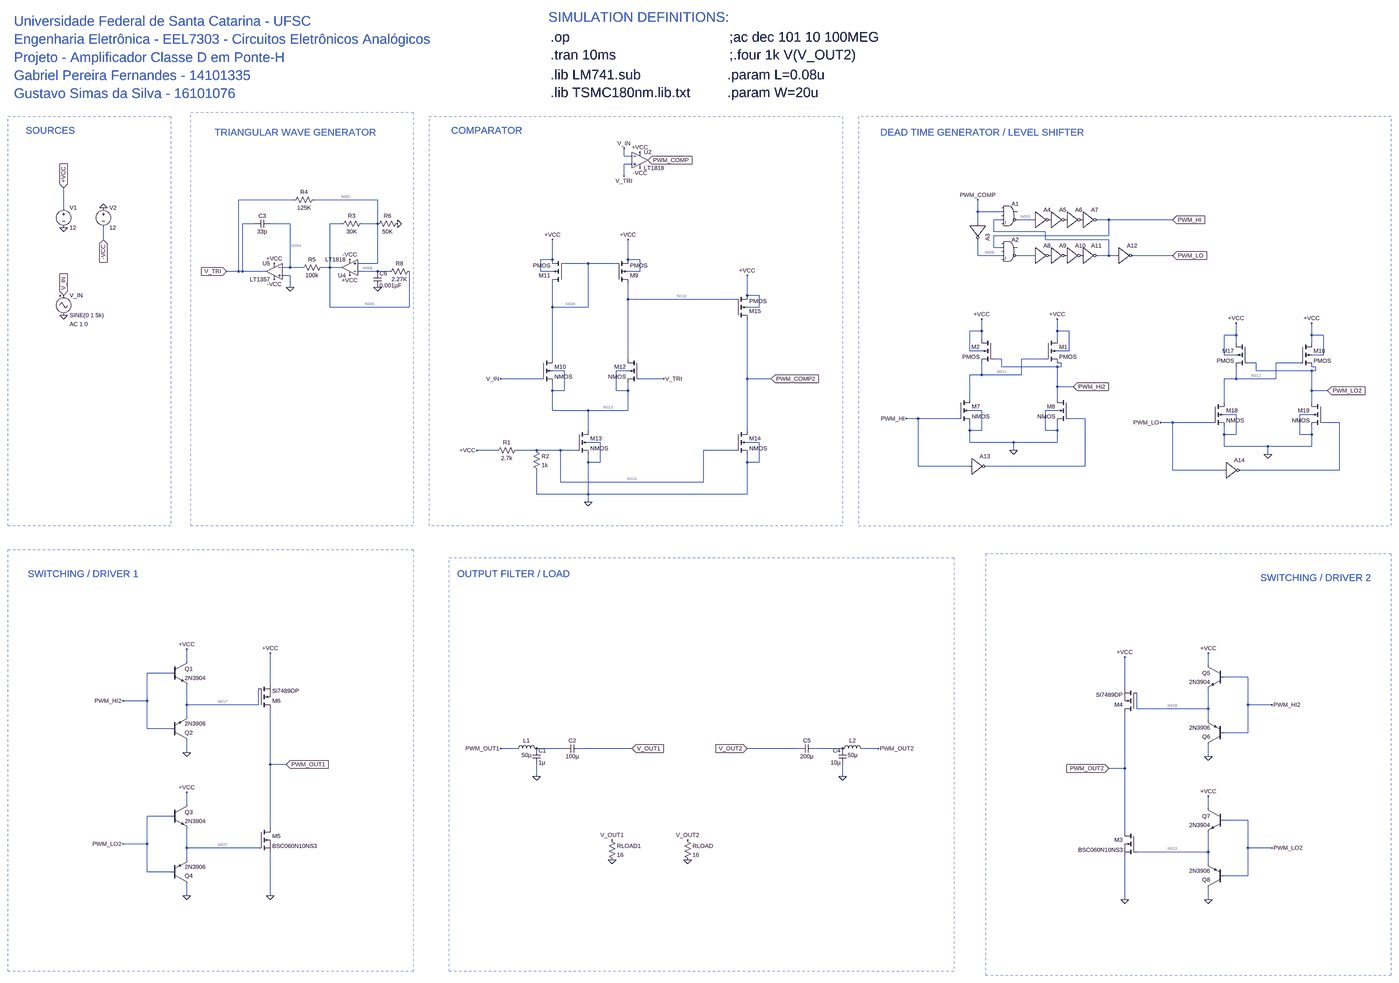
[diagram p0: schematic AmplificadorClasseD-V112.asc, whole sheet]
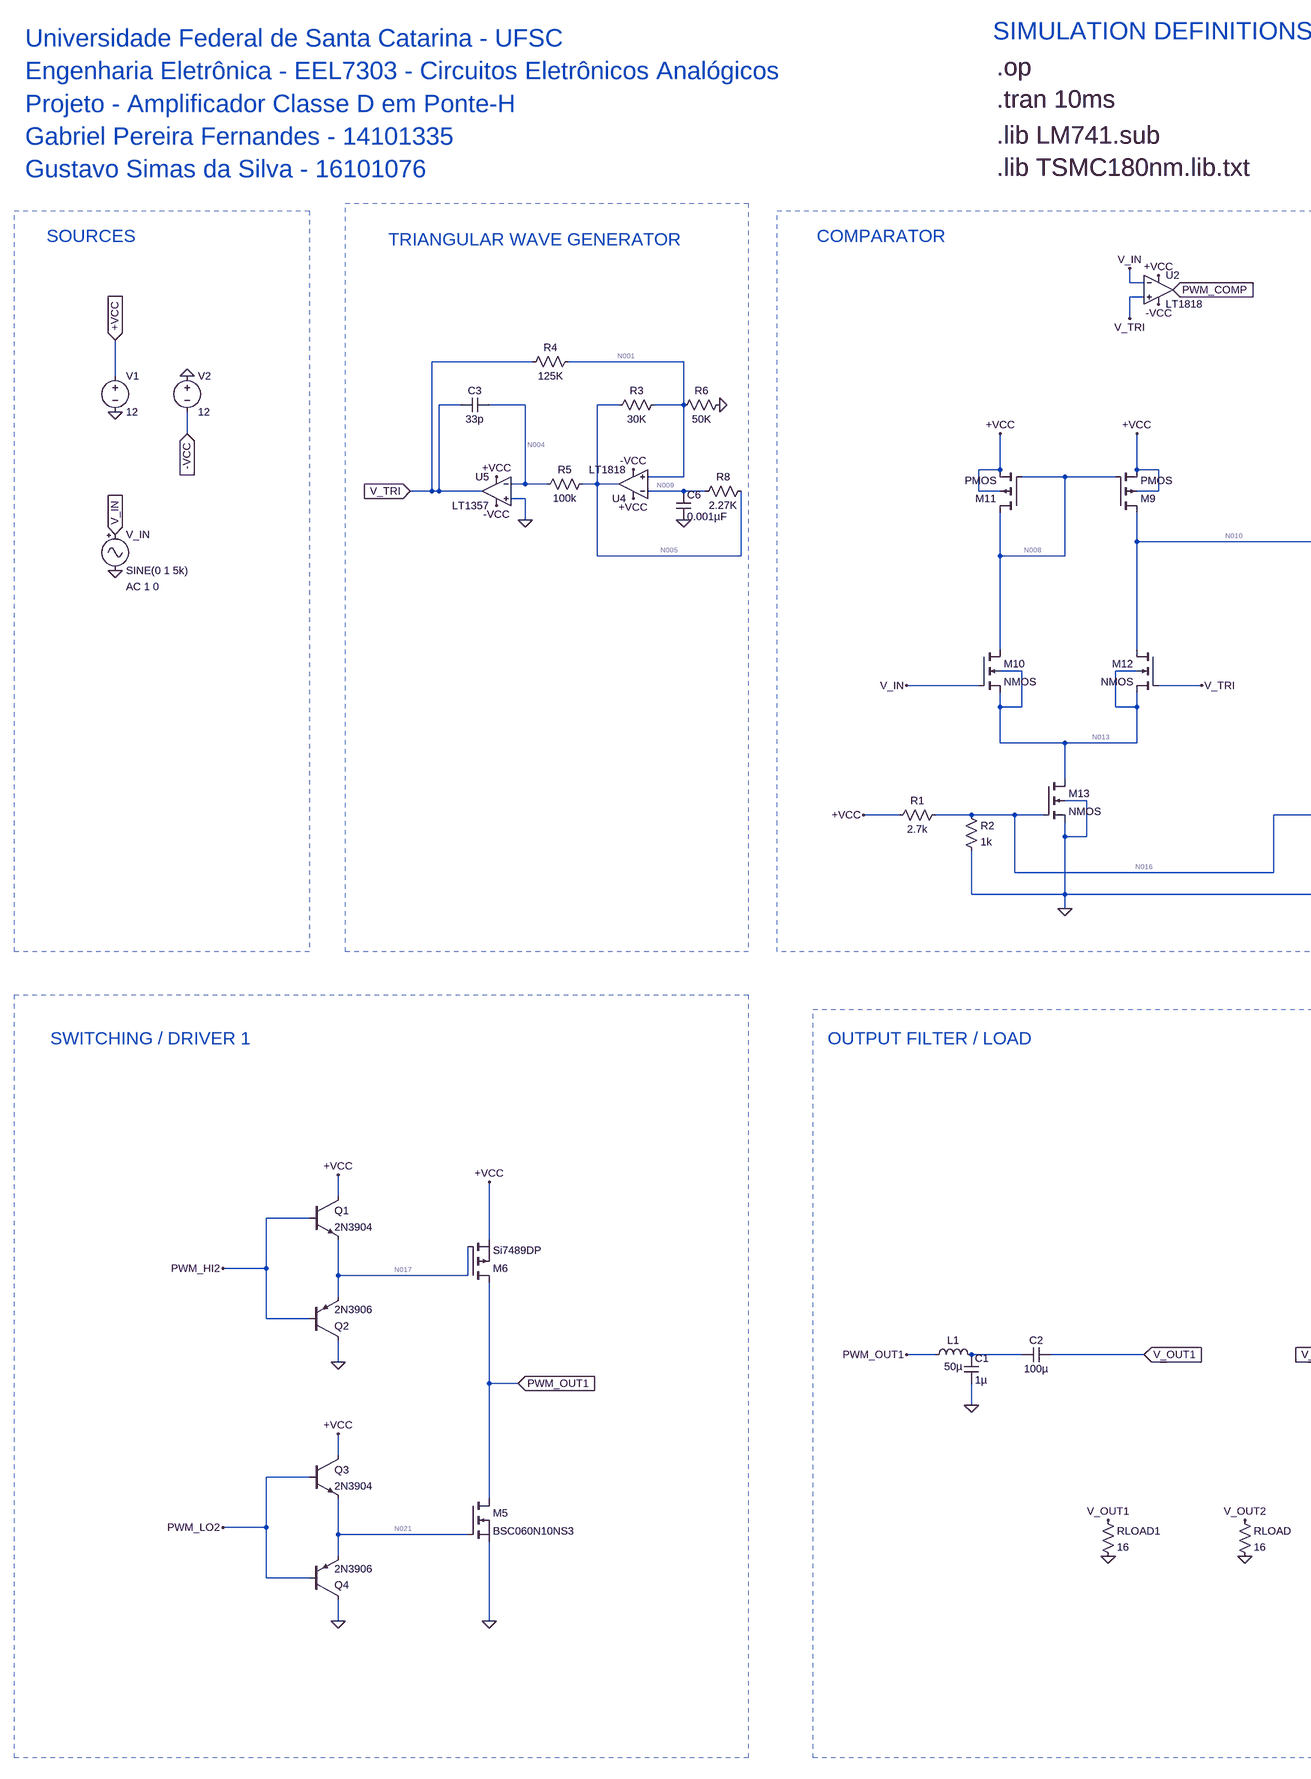
[diagram p1: schematic AmplificadorClasseD-V112.asc, part, row 1 of 1, column 1 of 2]
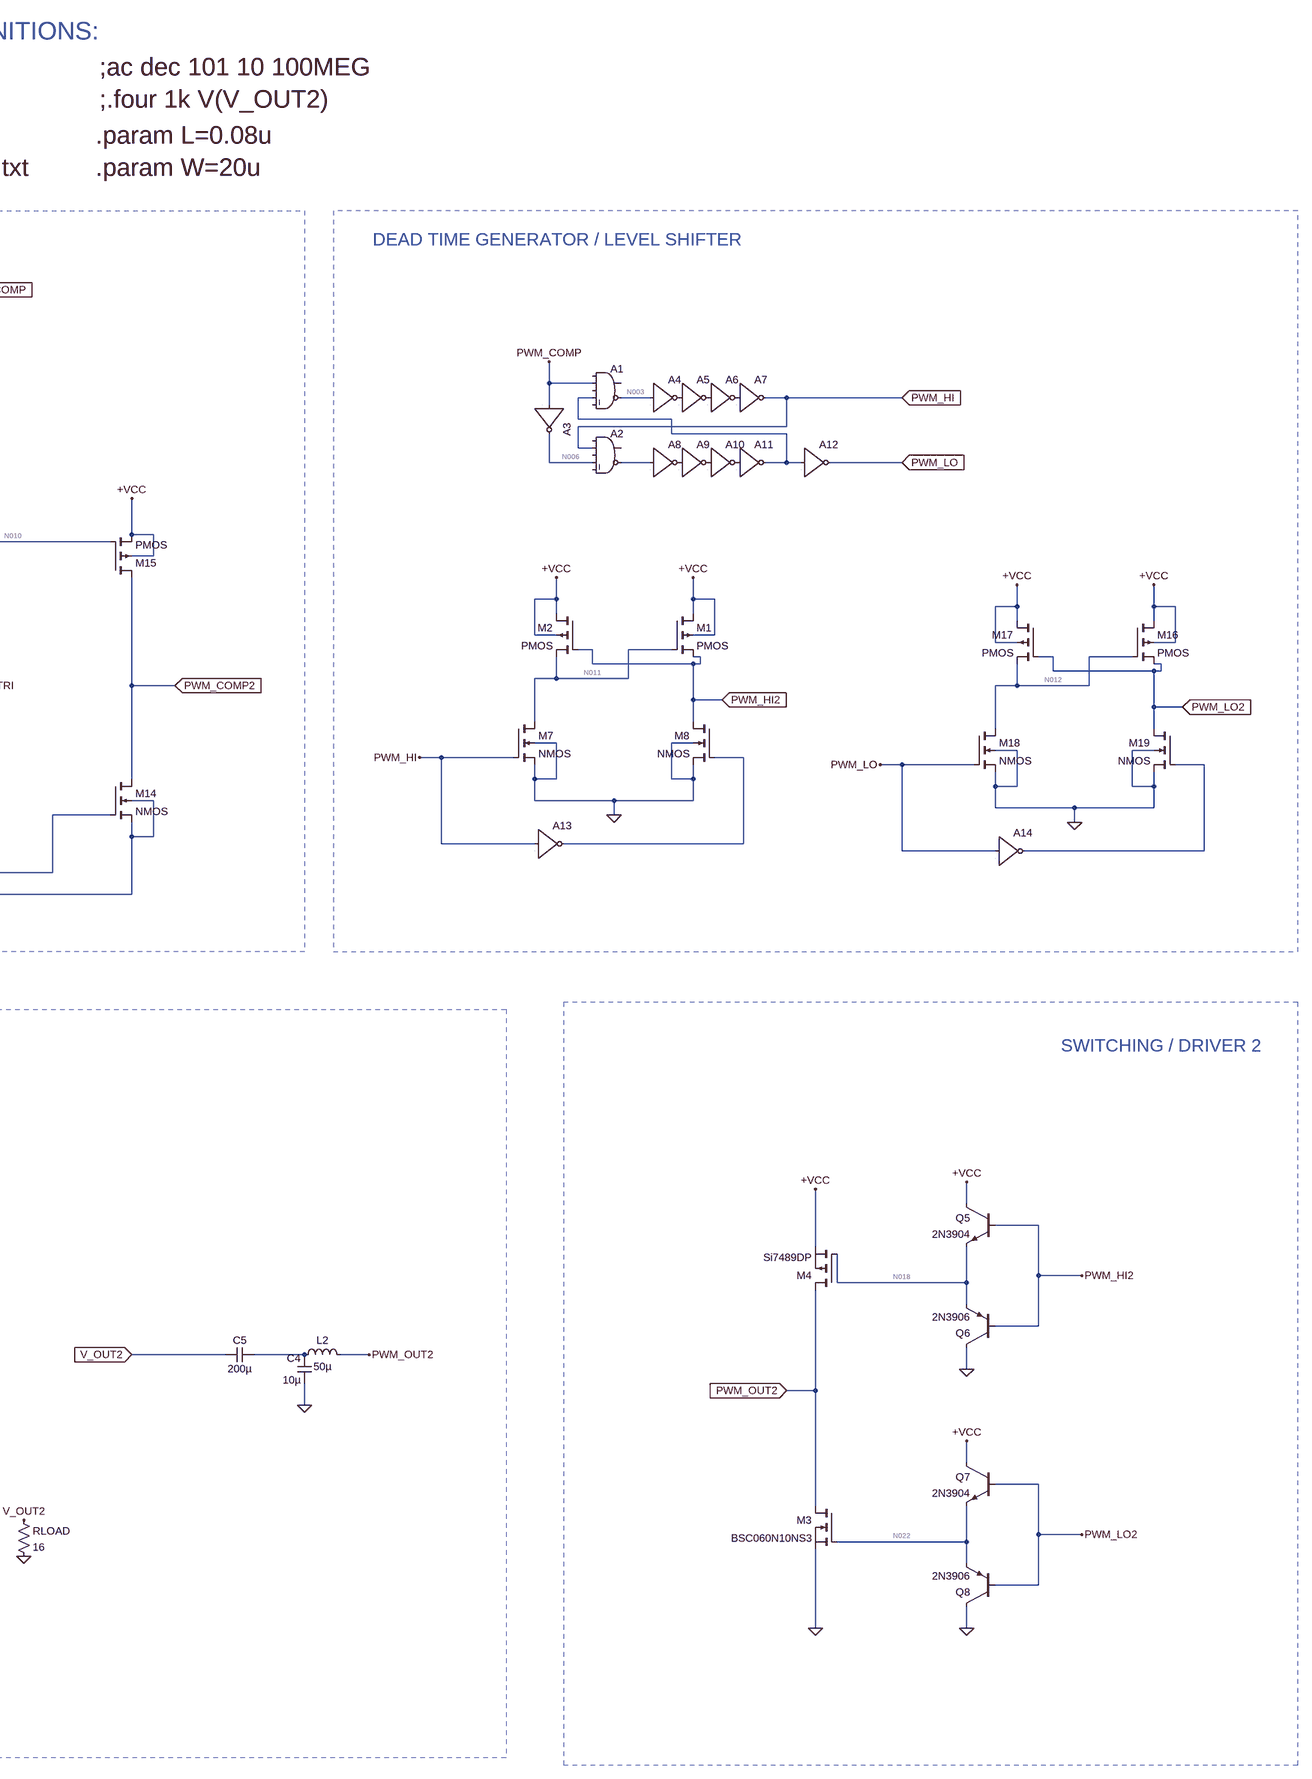
[diagram p2: schematic AmplificadorClasseD-V112.asc, part, row 1 of 1, column 2 of 2]
AmplificadorClasseD-V112.asc, the LTspice schematic file:
Version 4
SHEET 1 8820 3748
WIRE 1056 -560 1056 -592
WIRE 1088 -560 1056 -560
WIRE 1088 -528 1056 -528
WIRE 1056 -480 1056 -528
WIRE -272 -384 -496 -384
WIRE 64 -384 -192 -384
WIRE -1200 -352 -1200 -432
WIRE 2480 -336 2480 -384
WIRE 2576 -336 2480 -336
WIRE 2576 -304 2544 -304
WIRE 2704 -304 2640 -304
WIRE 3008 -304 2960 -304
WIRE 3264 -304 3008 -304
WIRE -432 -288 -480 -288
WIRE -288 -288 -368 -288
WIRE -80 -288 -128 -288
WIRE 64 -288 64 -384
WIRE 64 -288 0 -288
WIRE 2480 -288 2480 -336
WIRE 2544 -256 2544 -304
WIRE 2752 -256 2544 -256
WIRE 3008 -240 3008 -304
WIRE 3008 -240 2544 -240
WIRE -1040 -224 -1040 -272
WIRE 2752 -224 2752 -256
WIRE 3008 -224 2752 -224
WIRE 2544 -192 2544 -240
WIRE 2576 -192 2544 -192
WIRE 2480 -160 2480 -224
WIRE 2576 -160 2480 -160
WIRE 2704 -160 2640 -160
WIRE 3008 -160 3008 -224
WIRE 3008 -160 2960 -160
WIRE 3040 -160 3008 -160
WIRE 3264 -160 3104 -160
WIRE 768 -144 768 -224
WIRE 768 -144 720 -144
WIRE 1072 -144 1072 -224
WIRE 1120 -144 1072 -144
WIRE 64 -128 64 -288
WIRE 64 -128 -16 -128
WIRE 912 -128 816 -128
WIRE 1024 -128 912 -128
WIRE -288 -112 -288 -288
WIRE -288 -112 -320 -112
WIRE -240 -112 -288 -112
WIRE -128 -112 -128 -288
WIRE -128 -112 -160 -112
WIRE -80 -112 -128 -112
WIRE -496 -96 -496 -384
WIRE -496 -96 -544 -96
WIRE -480 -96 -480 -288
WIRE -480 -96 -496 -96
WIRE -384 -96 -480 -96
WIRE 64 -96 -16 -96
WIRE 112 -96 64 -96
WIRE 720 -96 720 -144
WIRE 768 -96 720 -96
WIRE 1120 -96 1120 -144
WIRE 1120 -96 1072 -96
WIRE -288 -80 -320 -80
WIRE -288 -32 -288 -80
WIRE 1552 0 1552 -80
WIRE 1600 0 1552 0
WIRE 1072 16 1072 -48
WIRE 1504 16 1072 16
WIRE -128 48 -128 -112
WIRE 192 48 192 -96
WIRE 192 48 -128 48
WIRE 768 48 768 -48
WIRE 912 48 912 -128
WIRE 912 48 768 48
WIRE 1600 48 1600 0
WIRE 1600 48 1552 48
WIRE 2496 144 2496 96
WIRE 2496 144 2448 144
WIRE 2800 144 2800 96
WIRE 2848 144 2800 144
WIRE 3520 160 3520 112
WIRE 3520 160 3472 160
WIRE 3824 160 3824 112
WIRE 3872 160 3824 160
WIRE 2496 176 2496 144
WIRE 2800 176 2800 144
WIRE 3520 192 3520 160
WIRE 3824 192 3824 160
WIRE 2448 224 2448 144
WIRE 2496 224 2448 224
WIRE 2848 224 2848 144
WIRE 2848 224 2800 224
WIRE 3472 240 3472 160
WIRE 3520 240 3472 240
WIRE 3872 240 3872 160
WIRE 3872 240 3824 240
WIRE 768 256 768 48
WIRE 1072 256 1072 16
WIRE 2576 256 2544 256
WIRE 2752 256 2656 256
WIRE 2816 272 2800 272
WIRE 3600 272 3568 272
WIRE 3776 272 3680 272
WIRE 2576 288 2576 256
WIRE 2800 288 2576 288
WIRE 2816 288 2816 272
WIRE 2816 288 2800 288
WIRE 3840 288 3824 288
WIRE 816 304 768 304
WIRE 1072 304 1024 304
WIRE 3600 304 3600 272
WIRE 3824 304 3600 304
WIRE 3840 304 3840 288
WIRE 3840 304 3824 304
WIRE 2496 320 2496 272
WIRE 2496 320 2448 320
WIRE 2656 320 2656 256
WIRE 2656 320 2496 320
WIRE 720 336 560 336
WIRE 1216 336 1120 336
WIRE 1552 336 1552 96
WIRE 1648 336 1552 336
WIRE 3520 336 3520 288
WIRE 3520 336 3472 336
WIRE 3680 336 3680 272
WIRE 3680 336 3520 336
WIRE 2800 368 2800 288
WIRE 2864 368 2800 368
WIRE 768 384 768 352
WIRE 816 384 816 304
WIRE 816 384 768 384
WIRE 1024 384 1024 304
WIRE 1072 384 1072 352
WIRE 1072 384 1024 384
WIRE 3824 384 3824 304
WIRE 3888 384 3824 384
WIRE 2448 416 2448 320
WIRE 2800 416 2800 368
WIRE 3472 432 3472 336
WIRE 3824 432 3824 384
WIRE 768 464 768 384
WIRE 912 464 768 464
WIRE 1072 464 1072 384
WIRE 1072 464 912 464
WIRE 2496 464 2448 464
WIRE 2800 464 2752 464
WIRE 3520 480 3472 480
WIRE 3824 480 3776 480
WIRE 2240 496 2192 496
WIRE 2400 496 2240 496
WIRE 2912 496 2848 496
WIRE 3264 512 3216 512
WIRE 3424 512 3264 512
WIRE 3936 512 3872 512
WIRE 912 544 912 464
WIRE 1552 544 1552 336
WIRE 2448 544 2448 512
WIRE 2496 544 2496 464
WIRE 2496 544 2448 544
WIRE 2752 544 2752 464
WIRE 2800 544 2800 512
WIRE 2800 544 2752 544
WIRE 3472 560 3472 528
WIRE 3520 560 3520 480
WIRE 3520 560 3472 560
WIRE 3776 560 3776 480
WIRE 3824 560 3824 528
WIRE 3824 560 3776 560
WIRE 960 592 912 592
WIRE 1600 592 1552 592
WIRE 2448 592 2448 544
WIRE 2624 592 2448 592
WIRE 2800 592 2800 544
WIRE 2800 592 2624 592
WIRE 3472 608 3472 560
WIRE 3648 608 3472 608
WIRE 3824 608 3824 560
WIRE 3824 608 3648 608
WIRE 544 624 464 624
WIRE 704 624 624 624
WIRE 800 624 704 624
WIRE 864 624 800 624
WIRE 1504 624 1376 624
WIRE 2624 624 2624 592
WIRE 3648 640 3648 608
WIRE 912 672 912 640
WIRE 960 672 960 592
WIRE 960 672 912 672
WIRE 1552 672 1552 640
WIRE 1600 672 1600 592
WIRE 1600 672 1552 672
WIRE 2240 688 2240 496
WIRE 2448 688 2240 688
WIRE 2912 688 2912 496
WIRE 2912 688 2512 688
WIRE 3264 704 3264 512
WIRE 3472 704 3264 704
WIRE 3936 704 3936 512
WIRE 3936 704 3536 704
WIRE 800 752 800 624
WIRE 1376 752 1376 624
WIRE 1376 752 800 752
WIRE 704 800 704 704
WIRE 912 800 912 672
WIRE 912 800 704 800
WIRE 1552 800 1552 672
WIRE 1552 800 912 800
WIRE 912 832 912 800
WIRE -704 1472 -704 1424
WIRE 3408 1488 3408 1440
WIRE -768 1520 -864 1520
WIRE 3568 1536 3472 1536
WIRE -368 1568 -368 1440
WIRE 3072 1584 3072 1456
WIRE -864 1632 -864 1520
WIRE -864 1632 -960 1632
WIRE -704 1648 -704 1568
WIRE -416 1648 -416 1584
WIRE -416 1648 -704 1648
WIRE 3568 1648 3568 1536
WIRE 3664 1648 3568 1648
WIRE 3120 1664 3120 1600
WIRE 3408 1664 3408 1584
WIRE 3408 1664 3120 1664
WIRE -704 1696 -704 1648
WIRE 3408 1712 3408 1664
WIRE -864 1744 -864 1632
WIRE -768 1744 -864 1744
WIRE 3568 1760 3568 1648
WIRE 3568 1760 3472 1760
WIRE 624 1824 560 1824
WIRE 816 1824 704 1824
WIRE 1088 1824 880 1824
WIRE 1760 1824 1552 1824
WIRE 1936 1824 1824 1824
WIRE 2080 1824 2016 1824
WIRE -704 1840 -704 1792
WIRE 3408 1856 3408 1808
WIRE -368 1888 -368 1664
WIRE -304 1888 -368 1888
WIRE 3072 1904 3072 1680
WIRE 3072 1904 3008 1904
WIRE 704 1936 704 1888
WIRE 1936 1936 1936 1888
WIRE -704 2048 -704 2000
WIRE 3408 2064 3408 2016
WIRE -768 2096 -864 2096
WIRE 3568 2112 3472 2112
WIRE -368 2144 -368 1888
WIRE 3072 2160 3072 1904
WIRE -864 2208 -864 2096
WIRE -864 2208 -960 2208
WIRE -704 2224 -704 2144
WIRE -416 2224 -704 2224
WIRE 3568 2224 3568 2112
WIRE 3664 2224 3568 2224
WIRE 3408 2240 3408 2160
WIRE 3408 2240 3120 2240
WIRE -704 2272 -704 2224
WIRE 3408 2288 3408 2240
WIRE -864 2320 -864 2208
WIRE -768 2320 -864 2320
WIRE 3568 2336 3568 2224
WIRE 3568 2336 3472 2336
WIRE -704 2416 -704 2368
WIRE -368 2416 -368 2240
WIRE 3072 2432 3072 2256
WIRE 3408 2432 3408 2384
FLAG -1200 -272 0
FLAG -1200 -432 +VCC
IOPIN -1200 -432 In
FLAG -1040 -352 0
FLAG -1040 -224 -VCC
IOPIN -1040 -224 In
FLAG -1200 80 0
FLAG -1200 0 V_IN
IOPIN -1200 0 In
FLAG 1152 -544 PWM_COMP
IOPIN 1152 -544 In
FLAG -352 -128 +VCC
FLAG -352 -64 -VCC
FLAG -288 -32 0
FLAG -544 -96 V_TRI
IOPIN -544 -96 In
FLAG 1936 1936 0
FLAG 1552 1824 V_OUT2
IOPIN 1552 1824 In
FLAG 2080 1824 PWM_OUT2
FLAG 2480 -384 PWM_COMP
FLAG 2192 496 PWM_HI
FLAG 3264 -304 PWM_HI
IOPIN 3264 -304 In
FLAG 3264 -160 PWM_LO
IOPIN 3264 -160 In
FLAG 2864 368 PWM_HI2
IOPIN 2864 368 In
FLAG 1120 -576 +VCC
FLAG 560 336 V_IN
FLAG 1216 336 V_TRI
FLAG 2496 96 +VCC
FLAG 2800 96 +VCC
FLAG 2624 624 0
FLAG 1072 -224 +VCC
FLAG 768 -224 +VCC
FLAG 912 832 0
FLAG 1552 -80 +VCC
FLAG 464 624 +VCC
FLAG 1056 -592 V_IN
FLAG 1056 -480 V_TRI
FLAG 1120 -512 -VCC
FLAG 1648 336 PWM_COMP2
IOPIN 1648 336 In
FLAG 1312 2272 0
FLAG 3216 512 PWM_LO
FLAG 3888 384 PWM_LO2
IOPIN 3888 384 In
FLAG 3520 112 +VCC
FLAG 3824 112 +VCC
FLAG 3648 640 0
FLAG 1312 2192 V_OUT2
FLAG -368 1440 +VCC
FLAG -704 1424 +VCC
FLAG -704 1840 0
FLAG -368 2416 0
FLAG -704 2000 +VCC
FLAG -704 2416 0
FLAG -304 1888 PWM_OUT1
IOPIN -304 1888 In
FLAG -960 1632 PWM_HI2
FLAG -960 2208 PWM_LO2
FLAG 704 1936 0
FLAG 1088 1824 V_OUT1
IOPIN 1088 1824 In
FLAG 560 1824 PWM_OUT1
FLAG 3072 1456 +VCC
FLAG 3408 1440 +VCC
FLAG 3408 1856 0
FLAG 3072 2432 0
FLAG 3408 2016 +VCC
FLAG 3408 2432 0
FLAG 3008 1904 PWM_OUT2
IOPIN 3008 1904 In
FLAG 3664 1648 PWM_HI2
FLAG 3664 2224 PWM_LO2
FLAG -48 -80 +VCC
FLAG -48 -144 -VCC
FLAG 64 -32 0
FLAG 144 -288 0
FLAG 1008 2272 0
FLAG 1008 2192 V_OUT1
SYMBOL voltage -1200 -368 R0
WINDOW 123 0 0 Left 0
WINDOW 39 0 0 Left 0
SYMATTR InstName V1
SYMATTR Value 12
SYMBOL voltage -1040 -368 R0
WINDOW 123 0 0 Left 0
WINDOW 39 0 0 Left 0
SYMATTR InstName V2
SYMATTR Value 12
SYMBOL Misc\\signal -1200 -16 R0
WINDOW 123 24 132 Left 2
WINDOW 39 0 0 Left 0
SYMATTR Value2 AC 1 0
SYMATTR InstName V_IN
SYMATTR Value SINE(0 1 5k)
SYMBOL Opamps\\LT1357 -352 -160 M0
SYMATTR InstName U5
SYMBOL res -144 -128 R90
WINDOW 0 0 56 VBottom 2
WINDOW 3 32 56 VTop 2
SYMATTR InstName R5
SYMATTR Value 100k
SYMBOL cap -368 -304 R90
WINDOW 0 0 32 VBottom 2
WINDOW 3 32 32 VTop 2
SYMATTR InstName C3
SYMATTR Value 33p
SYMBOL res 1296 2176 R0
SYMATTR InstName RLOAD
SYMATTR Value 16
SYMBOL ind 2032 1840 M270
WINDOW 0 32 56 VTop 2
WINDOW 3 5 56 VBottom 2
SYMATTR InstName L2
SYMATTR Value 50µ
SYMBOL cap 1952 1824 M0
SYMATTR InstName C4
SYMATTR Value 10µ
SYMBOL Digital\\and 2608 -384 R0
SYMATTR InstName A1
SYMBOL Digital\\and 2608 -240 R0
SYMATTR InstName A2
SYMBOL Digital\\inv 2544 -288 R90
SYMATTR InstName A3
SYMBOL Digital\\inv 2704 -368 R0
SYMATTR InstName A4
SYMBOL Digital\\inv 2768 -368 R0
SYMATTR InstName A5
SYMBOL Digital\\inv 2832 -368 R0
SYMATTR InstName A6
SYMBOL Digital\\inv 2896 -368 R0
SYMATTR InstName A7
SYMBOL Digital\\inv 2704 -224 R0
SYMATTR InstName A8
SYMBOL Digital\\inv 2768 -224 R0
SYMATTR InstName A9
SYMBOL Digital\\inv 2832 -224 R0
SYMATTR InstName A10
SYMBOL Digital\\inv 2896 -224 R0
SYMATTR InstName A11
SYMBOL pmos4 2752 176 R0
SYMATTR InstName M1
SYMATTR Value2 l={L} w={W}
SYMBOL pmos4 2544 176 M0
SYMATTR InstName M2
SYMATTR Value2 l={L} w={W}
SYMBOL nmos4 2400 416 R0
SYMATTR InstName M7
SYMATTR Value2 l={L} w={W}
SYMBOL nmos4 2848 416 M0
SYMATTR InstName M8
SYMATTR Value2 l={L} w={W}
SYMBOL Digital\\inv 2448 624 R0
SYMATTR InstName A13
SYMBOL pmos4 1024 -48 M180
SYMATTR InstName M9
SYMATTR Value2 l={L} w={W}
SYMBOL nmos4 720 256 R0
SYMATTR InstName M10
SYMATTR Value2 l={L} w={W}
SYMBOL pmos4 816 -48 R180
SYMATTR InstName M11
SYMATTR Value2 l={L} w={W}
SYMBOL nmos4 1120 256 M0
SYMATTR InstName M12
SYMATTR Value2 l={L} w={W}
SYMBOL nmos4 864 544 R0
SYMATTR InstName M13
SYMATTR Value2 l={L} w={W}
SYMBOL nmos4 1504 544 R0
SYMATTR InstName M14
SYMATTR Value2 l={L} w={W}
SYMBOL pmos4 1504 96 M180
SYMATTR InstName M15
SYMATTR Value2 l={L} w={W}
SYMBOL res 640 608 R90
WINDOW 0 0 56 VBottom 2
WINDOW 3 32 56 VTop 2
SYMATTR InstName R1
SYMATTR Value 2.7k
SYMBOL res 688 608 R0
SYMATTR InstName R2
SYMATTR Value 1k
SYMBOL pmos4 3776 192 R0
SYMATTR InstName M16
SYMATTR Value2 l={L} w={W}
SYMBOL pmos4 3568 192 M0
SYMATTR InstName M17
SYMATTR Value2 l={L} w={W}
SYMBOL nmos4 3424 432 R0
SYMATTR InstName M18
SYMATTR Value2 l={L} w={W}
SYMBOL nmos4 3872 432 M0
SYMATTR InstName M19
SYMATTR Value2 l={L} w={W}
SYMBOL Digital\\inv 3472 640 R0
SYMATTR InstName A14
SYMBOL cap 1824 1808 R90
WINDOW 0 0 32 VBottom 2
WINDOW 3 32 32 VTop 2
SYMATTR InstName C5
SYMATTR Value 200µ
SYMBOL Digital\\inv 3040 -224 R0
SYMATTR InstName A12
SYMBOL nmos -416 2144 R0
SYMATTR InstName M5
SYMATTR Value BSC060N10NS3
SYMBOL pmos -416 1664 M180
SYMATTR InstName M6
SYMATTR Value Si7489DP
SYMBOL npn -768 1472 R0
SYMATTR InstName Q1
SYMATTR Value 2N3904
SYMBOL pnp -768 1792 M180
SYMATTR InstName Q2
SYMATTR Value 2N3906
SYMBOL npn -768 2048 R0
SYMATTR InstName Q3
SYMATTR Value 2N3904
SYMBOL pnp -768 2368 M180
SYMATTR InstName Q4
SYMATTR Value 2N3906
SYMBOL ind 608 1840 R270
WINDOW 0 32 56 VTop 2
WINDOW 3 5 56 VBottom 2
SYMATTR InstName L1
SYMATTR Value 50µ
SYMBOL cap 688 1824 R0
SYMATTR InstName C1
SYMATTR Value 1µ
SYMBOL cap 816 1808 M90
WINDOW 0 0 32 VBottom 2
WINDOW 3 32 32 VTop 2
SYMATTR InstName C2
SYMATTR Value 100µ
SYMBOL nmos 3120 2160 M0
SYMATTR InstName M3
SYMATTR Value BSC060N10NS3
SYMBOL pmos 3120 1680 R180
SYMATTR InstName M4
SYMATTR Value Si7489DP
SYMBOL npn 3472 1488 M0
SYMATTR InstName Q5
SYMATTR Value 2N3904
SYMBOL pnp 3472 1808 R180
SYMATTR InstName Q6
SYMATTR Value 2N3906
SYMBOL npn 3472 2064 M0
SYMATTR InstName Q7
SYMATTR Value 2N3904
SYMBOL pnp 3472 2384 R180
SYMATTR InstName Q8
SYMATTR Value 2N3906
SYMBOL res 16 -304 R90
WINDOW 0 0 56 VBottom 2
WINDOW 3 32 56 VTop 2
SYMATTR InstName R3
SYMATTR Value 30K
SYMBOL cap 48 -96 R0
SYMATTR InstName C6
SYMATTR Value 0.001µF
SYMBOL res 208 -112 R90
WINDOW 0 0 56 VBottom 2
WINDOW 3 32 56 VTop 2
SYMATTR InstName R8
SYMATTR Value 2.27K
SYMBOL Opamps\\LT1818 -48 -112 R180
SYMATTR InstName U4
SYMBOL res -176 -400 R90
WINDOW 0 0 56 VBottom 2
WINDOW 3 32 56 VTop 2
SYMATTR InstName R4
SYMATTR Value 125K
SYMBOL res 160 -304 R90
WINDOW 0 0 56 VBottom 2
WINDOW 3 32 56 VTop 2
SYMATTR InstName R6
SYMATTR Value 50K
SYMBOL Opamps\\LT1818 1120 -544 R0
SYMATTR InstName U2
SYMBOL res 992 2176 R0
SYMATTR InstName RLOAD1
SYMATTR Value 16
TEXT 760 -968 Left 5 !.tran 10ms
TEXT 760 -888 Left 5 !.lib LM741.sub
TEXT -1400 -1104 Left 5 ;Universidade Federal de Santa Catarina - UFSC\nEngenharia Eletrônica - EEL7303 - Circuitos Eletrônicos Analógicos\nProjeto - Amplificador Classe D em Ponte-H\nGabriel Pereira Fernandes - 14101335\nGustavo Simas da Silva - 16101076
TEXT 752 -1120 Left 5 ;SIMULATION DEFINITIONS:
TEXT 760 -1040 Left 5 !.op
TEXT -1352 -664 Left 4 ;SOURCES
TEXT -592 -656 Left 4 ;TRIANGULAR WAVE GENERATOR
TEXT 360 -664 Left 4 ;COMPARATOR
TEXT 2088 -656 Left 4 ;DEAD TIME GENERATOR / LEVEL SHIFTER
TEXT -1344 1120 Left 4 ;SWITCHING / DRIVER 1
TEXT 384 1120 Left 4 ;OUTPUT FILTER / LOAD
TEXT 760 -816 Left 5 !.lib TSMC180nm.lib.txt
TEXT 1472 -888 Left 5 !.param L=0.08u
TEXT 1472 -816 Left 5 !.param W=20u
TEXT 4064 1136 Right 4 ;SWITCHING / DRIVER 2
TEXT 1480 -1040 Left 5 !;ac dec 101 10 100MEG
TEXT 1480 -968 Left 5 !;.four 1k V(V_OUT2)
RECTANGLE Normal -768 928 -1424 -720 2
RECTANGLE Normal 1936 928 272 -720 2
RECTANGLE Normal 2384 2720 352 1056 2
RECTANGLE Normal 208 928 -688 -736 2
RECTANGLE Normal 208 2720 -1424 1024 2
RECTANGLE Normal 2512 2736 4144 1040 2
RECTANGLE Normal 4144 -720 2000 928 2

The netlist it stands for:
* AmplificadorClasseD-V112.asc
V1 +VCC 0 12
V2 0 -VCC 12
V_IN V_IN 0 SINE(0 1 5k) AC 1 0
XU5 0 N004 +VCC -VCC V_TRI LT1357  ; pins In+ In- V+ V- OUT
R5 N005 N004 100k
C3 N004 V_TRI 33p
RLOAD V_OUT2 0 16
L2 PWM_OUT2 N020 50µ
C4 N020 0 10µ
A1 0 PWM_COMP 0 N002 0 N003 0 0 AND
A2 0 PWM_HI 0 N006 0 N007 0 0 AND
A3 PWM_COMP 0 0 0 0 N006 0 0 BUF
A4 N003 0 0 0 0 P001 0 0 BUF
A5 P001 0 0 0 0 P002 0 0 BUF
A6 P002 0 0 0 0 P003 0 0 BUF
A7 P003 0 0 0 0 PWM_HI 0 0 BUF
A8 N007 0 0 0 0 P004 0 0 BUF
A9 P004 0 0 0 0 P005 0 0 BUF
A10 P005 0 0 0 0 P006 0 0 BUF
A11 P006 0 0 0 0 N002 0 0 BUF
M1 +VCC N011 PWM_HI2 +VCC PMOS l={L} w={W}
M2 +VCC PWM_HI2 N011 +VCC PMOS l={L} w={W}
M7 N011 PWM_HI 0 0 NMOS l={L} w={W}
M8 PWM_HI2 N014 0 0 NMOS l={L} w={W}
A13 PWM_HI 0 0 0 0 N014 0 0 BUF
M9 N010 N008 +VCC +VCC PMOS l={L} w={W}
M10 N008 V_IN N013 N013 NMOS l={L} w={W}
M11 N008 N008 +VCC +VCC PMOS l={L} w={W}
M12 N010 V_TRI N013 N013 NMOS l={L} w={W}
M13 N013 N016 0 0 NMOS l={L} w={W}
M14 PWM_COMP2 N016 0 0 NMOS l={L} w={W}
M15 PWM_COMP2 N010 +VCC +VCC PMOS l={L} w={W}
R1 N016 +VCC 2.7k
R2 N016 0 1k
M16 +VCC N012 PWM_LO2 +VCC PMOS l={L} w={W}
M17 +VCC PWM_LO2 N012 +VCC PMOS l={L} w={W}
M18 N012 PWM_LO 0 0 NMOS l={L} w={W}
M19 PWM_LO2 N015 0 0 NMOS l={L} w={W}
A14 PWM_LO 0 0 0 0 N015 0 0 BUF
C5 N020 V_OUT2 200µ
A12 N002 0 0 0 0 PWM_LO 0 0 BUF
M5 PWM_OUT1 N021 0 0 BSC060N10NS3
M6 PWM_OUT1 N017 +VCC +VCC Si7489DP
Q1 +VCC PWM_HI2 N017 0 2N3904
Q2 0 PWM_HI2 N017 0 2N3906
Q3 +VCC PWM_LO2 N021 0 2N3904
Q4 0 PWM_LO2 N021 0 2N3906
L1 PWM_OUT1 N019 50µ
C1 N019 0 1µ
C2 N019 V_OUT1 100µ
M3 PWM_OUT2 N022 0 0 BSC060N10NS3
M4 PWM_OUT2 N018 +VCC +VCC Si7489DP
Q5 +VCC PWM_HI2 N018 0 2N3904
Q6 0 PWM_HI2 N018 0 2N3906
Q7 +VCC PWM_LO2 N022 0 2N3904
Q8 0 PWM_LO2 N022 0 2N3906
R3 N001 N005 30K
C6 N009 0 0.001µF
R8 N005 N009 2.27K
XU4 N001 N009 N005 +VCC -VCC LT1818  ; pins In+ In- OUT V+ V-
R4 N001 V_TRI 125K
R6 0 N001 50K
XU2 V_TRI V_IN PWM_COMP +VCC -VCC LT1818  ; pins In+ In- OUT V+ V-
RLOAD1 V_OUT1 0 16
.model NPN NPN
.model PNP PNP
.lib standard.bjt
.model NMOS NMOS
.model PMOS PMOS
.lib standard.mos
.tran 10ms
.lib LM741.sub
* Universidade Federal de Santa Catarina - UFSC
* Engenharia Eletrônica - EEL7303 - Circuitos Eletrônicos Analógicos
* Projeto - Amplificador Classe D em Ponte-H
* Gabriel Pereira Fernandes - 14101335
* Gustavo Simas da Silva - 16101076
* SIMULATION DEFINITIONS:
.op
* SOURCES
* TRIANGULAR WAVE GENERATOR
* COMPARATOR
* DEAD TIME GENERATOR / LEVEL SHIFTER
* SWITCHING / DRIVER 1
* OUTPUT FILTER / LOAD
.lib TSMC180nm.lib.txt
.param L=0.08u
.param W=20u
* SWITCHING / DRIVER 2
;ac dec 101 10 100MEG
;.four 1k V(V_OUT2)
.lib LTC2.lib
.backanno
.end

* Results of the author's LTspice run, read from the files saved beside the schematic
* Operating Point, zero values left out:
*   V(+vcc) = 12 V
*   V(-vcc) = -12 V
*   V(n004) = 3.733 µV
*   V(v_tri) = -247.9 mV
*   V(n005) = 12.06 mV
*   V(pwm_comp) = -11.11 V
*   V(n003) = 1 V
*   V(pwm_hi) = 1 V
*   V(n006) = 1 V
*   V(p002) = 1 V
*   V(p004) = 1 V
*   V(p006) = 1 V
*   V(n011) = 2.325 V
*   V(pwm_hi2) = 12 V
*   V(n010) = 12 V
*   V(n008) = 11.45 V
*   V(n013) = 3.054 µV
*   V(n016) = 3.243 V
*   V(pwm_comp2) = 242.9 mV
*   V(n012) = 2.325 V
*   V(pwm_lo2) = 12 V
*   V(pwm_lo) = 1 V
*   V(n021) = 11.99 V
*   V(n017) = 11.99 V
*   V(n022) = 11.99 V
*   V(n018) = 11.98 V
*   V(n001) = 18.19 mV
*   V(n009) = 18.19 mV
*   Ic(Q8) = -12.01 pA
*   Ib(Q8) = 12.01 pA
*   Ic(Q6) = -12.01 pA
*   Ib(Q6) = 12.02 pA
*   Ic(Q4) = -12.01 pA
*   Ib(Q4) = 12.01 pA
*   Ic(Q2) = -12.01 pA
*   Ib(Q2) = 12.01 pA
*   Id(M19) = 246.1 nA
*   Ib(M19) = -12.01 pA
*   Is(M19) = -246 nA
*   Id(M18) = 7.56 mA
*   Ib(M18) = -2.335 pA
*   Is(M18) = -7.56 mA
*   Id(M14) = 12.06 mA
*   Is(M14) = -12.06 mA
*   Id(M13) = 182.6 nA
*   Is(M13) = -182.6 nA
*   Id(M12) = 413.8 pA
*   Ib(M12) = -12.01 pA
*   Is(M12) = -401.8 pA
*   Id(M10) = 182.2 nA
*   Ib(M10) = -11.46 pA
*   Is(M10) = -182.2 nA
*   Id(M8) = 246.1 nA
*   Ib(M8) = -12.01 pA
*   Is(M8) = -246 nA
*   Id(M7) = 7.56 mA
*   Ib(M7) = -2.335 pA
*   Is(M7) = -7.56 mA
*   Id(M17) = 7.56 mA
*   Ib(M17) = 9.685 pA
*   Is(M17) = -7.56 mA
*   Id(M16) = 246.1 nA
*   Is(M16) = -246.1 nA
*   Id(M15) = -12.06 mA
*   Ib(M15) = 11.77 pA
*   Is(M15) = 12.06 mA
*   Id(M11) = -182.2 nA
*   Is(M11) = 182.2 nA
*   Id(M9) = -413.8 pA
*   Is(M9) = 413.8 pA
*   Id(M2) = 7.56 mA
*   Ib(M2) = 9.685 pA
*   Is(M2) = -7.56 mA
*   Id(M1) = 246.1 nA
*   Is(M1) = -246.1 nA
*   Id(M4) = -15.6 pA
*   Is(M4) = 15.6 pA
*   Id(M6) = -15.6 pA
*   Is(M6) = 15.6 pA
*   Id(M3) = 27.77 pA
*   Is(M3) = -27.77 pA
*   Id(M5) = 27.76 pA
*   Is(M5) = -27.76 pA
*   I(R6) = -363.8 nA
*   I(R4) = 2.129 µA
*   I(R8) = -2.697 µA
*   I(R3) = 204.2 nA
*   I(R2) = 3.243 mA
*   I(R1) = -3.243 mA
*   I(R5) = 120.6 nA
*   I(V_in) = 2.368 µA
*   I(V2) = -22.78 mA
*   I(V1) = -53.21 mA
*   Ix(u5:1) = 120.6 nA
*   Ix(u5:2) = 120.6 nA
*   Ix(u5:3) = 1.982 mA
*   Ix(u5:4) = -1.988 mA
*   Ix(u5:5) = 5.183 µA
*   Ix(u4:1) = -2.697 µA
*   Ix(u4:2) = -2.697 µA
*   Ix(u4:3) = 2.781 µA
*   Ix(u4:4) = 10.4 mA
*   Ix(u4:5) = -10.4 mA
*   Ix(u2:1) = -3.054 µA
*   Ix(u2:2) = -2.368 µA
*   Ix(u2:3) = 22.23 pA
*   Ix(u2:4) = 10.4 mA
*   Ix(u2:5) = -10.4 mA